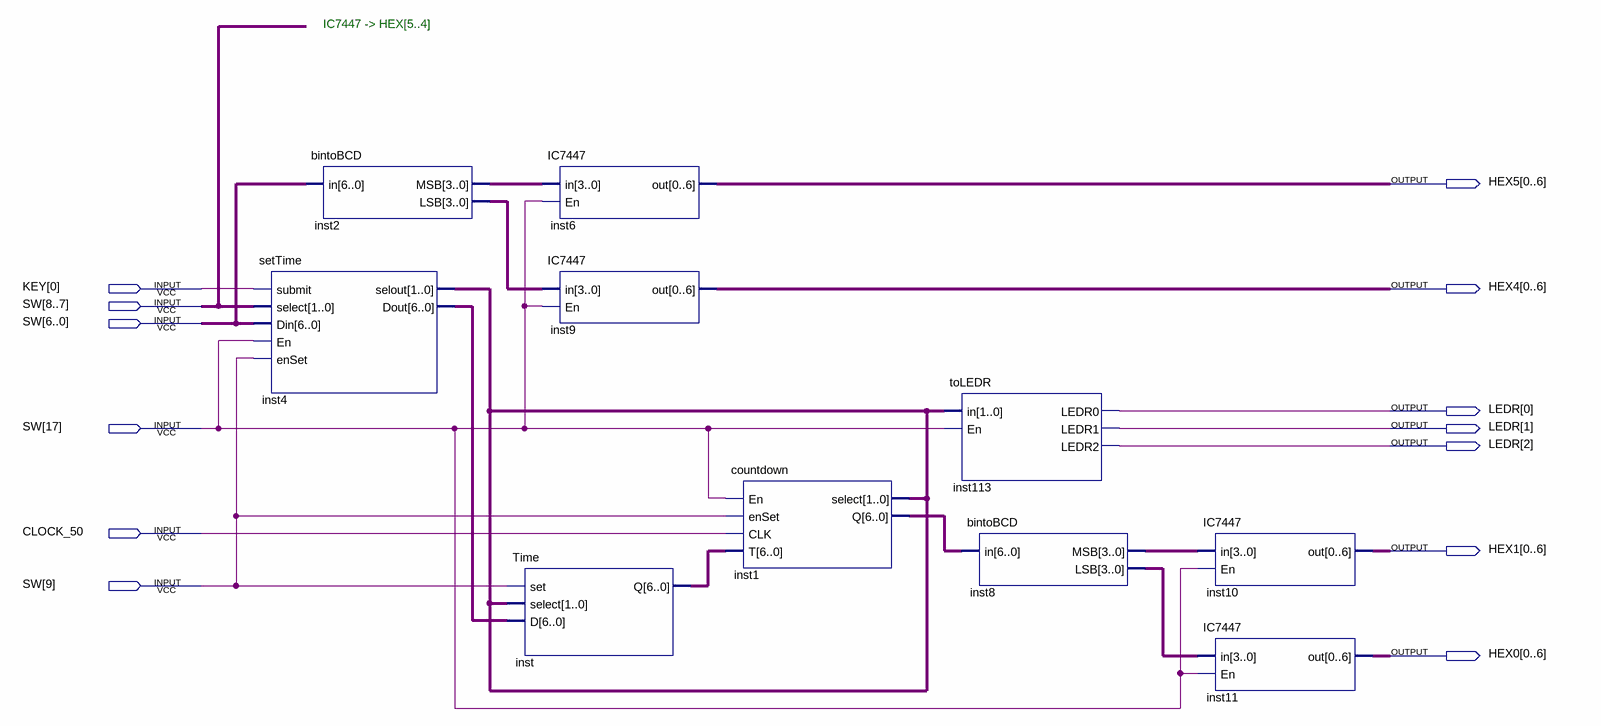
[diagram p0: schematic sheet]
// Quartus schematic MiniProject.bdf as structural Verilog: 10 symbols, 13 pins
module MiniProject (
  input  [0:0] KEY,
  input  [17:0] SW,
  input  CLOCK_50,
  output [0:6] HEX5,
  output [0:6] HEX4,
  output [2:0] LEDR,
  output [0:6] HEX1,
  output [0:6] HEX0
);

  wire [1:0] inst4_selout;
  wire [3:0] inst2_lsb, inst2_msb, inst8_lsb, inst8_msb;
  wire [6:0] inst1_q, inst4_dout, inst_q;

  setTime inst4 (
    .submit(KEY[0]), .select(SW[8:7]), .Din(SW[6:0]), .En(SW[17]), .enSet(SW[9]), .selout(inst4_selout),
    .Dout(inst4_dout));
  bintoBCD inst2 (.in(SW[6:0]), .MSB(inst2_msb), .LSB(inst2_lsb));
  IC7447 inst6 (.in(inst2_msb), .En(SW[17]), .out(HEX5));
  IC7447 inst9 (.in(inst2_lsb), .En(SW[17]), .out(HEX4));
  Time inst (.set(SW[9]), .select(inst4_selout), .D(inst4_dout), .Q(inst_q));
  countdown inst1 (.En(SW[17]), .enSet(SW[9]), .CLK(CLOCK_50), .T(inst_q), .select(inst4_selout), .Q(inst1_q));
  toLEDR inst113 (.in(inst4_selout), .En(SW[17]), .LEDR0(LEDR[0]), .LEDR1(LEDR[1]), .LEDR2(LEDR[2]));
  bintoBCD inst8 (.in(inst1_q), .MSB(inst8_msb), .LSB(inst8_lsb));
  IC7447 inst10 (.in(inst8_msb), .En(SW[17]), .out(HEX1));
  IC7447 inst11 (.in(inst8_lsb), .En(SW[17]), .out(HEX0));

  // Notes on the sheet:
  //   IC7447 -> HEX[5..4]
endmodule
